# Altium schematic sheet lm1875 amplifier.SchDoc
size A3; SheetNumber: 1; SheetTotal: 1
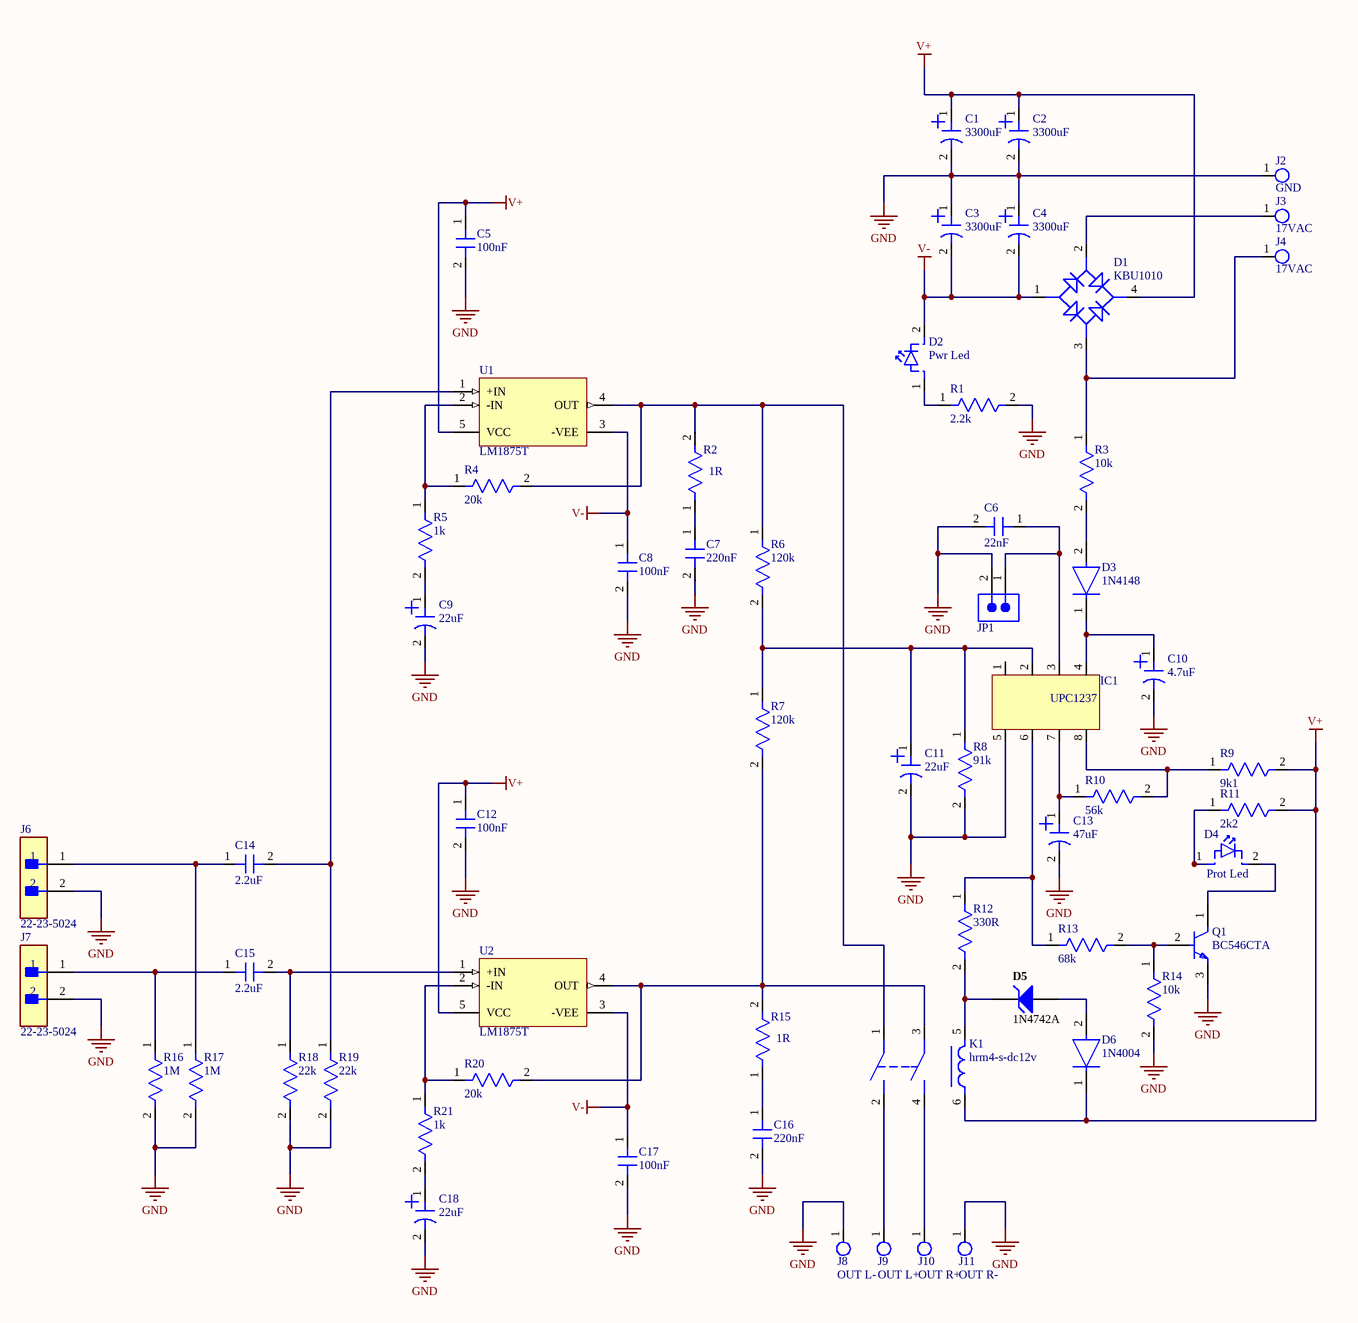
[diagram p0: lm1875 amplifier.SchDoc]

## Parts
C1  3300uF  [Capacitor electrolytic 16x21mm]
C2  3300uF  [Capacitor electrolytic 16x21mm]
C3  3300uF  [Capacitor electrolytic 16x21mm]
C4  3300uF  [Capacitor electrolytic 16x21mm]
C5  100nF  [Capacitor 3x7mm]
C6  22nF  [Capacitor 2.5x5mm]
C7  220nF  [Capacitor MKT 5x13mm]
C8  100nF  [Capacitor 3x7mm]
C9  22uF  [Capacitor 5x11mm]
C10  4.7uF  [Capacitor 5x11mm]
C11  22uF  [Capacitor 5x11mm]
C12  100nF  [Capacitor 3x7mm]
C13  47uF  [Capacitor 6x11mm]
C14  2.2uF  [Capacitor Bipolar 10x16mm Axial]
C15  2.2uF  [Capacitor Bipolar 10x16mm Axial]
C16  220nF  [Capacitor MKT 5x13mm]
C17  100nF  [Capacitor 3x7mm]
C18  22uF  [Capacitor 5x11mm]
D1  KBU1010  [KBU Rectifier]
D2  Pwr Led  [led 3mm]
D3  1N4148  [FP-017AG-MFG]
D4  Prot Led  [led 3mm]
D5  1N4742A  [FAIR-DO-41-2_V]
D6  1N4004  [FP-DO-41-MFG]
IC1  UPC1237  [SIP 8 PIN]
J2  GND  [Terminal 6.3mm male]
J3  17VAC  [Terminal 6.3mm male]
J4  17VAC  [Terminal 6.3mm male]
J6  22-23-5024  [FP-22-23-5024-MFG]
J7  22-23-5024  [FP-22-23-5024-MFG]
J8  OUT L-  [Terminal 6.3mm male]
J9  OUT L+  [Terminal 6.3mm male]
J10  OUT R+  [Terminal 6.3mm male]
J11  OUT R-  [Terminal 6.3mm male]
JP1  (no value)  [61300211121]
K1  hrm4-s-dc12v  [Relay hrm4-s-dc12v]
Q1  BC546CTA  [FP-135AR-MFG]
R1  2.2k  [Resistor 0207 1/4W]
R2  1R  [Resistor 1W]
R3  10k  [Resistor 0207 1/4W]
R4  20k  [Resistor 0207 1/4W wide legs]
R5  1k  [Resistor 0207 1/4W]
R6  120k  [Resistor 0207 1/4W]
R7  120k  [Resistor 0207 1/4W]
R8  91k  [Resistor 0207 1/4W]
R9  9k1  [Resistor 0207 1/4W]
R10  56k  [Resistor 0207 1/4W]
R11  2k2  [Resistor 0207 1/4W]
R12  330R  [Resistor 0207 1/4W]
R13  68k  [Resistor 0207 1/4W]
R14  10k  [Resistor 0207 1/4W]
R15  1R  [Resistor 1W]
R16  1M  [Resistor 0207 1/4W]
R17  1M  [Resistor 0207 1/4W]
R18  22k  [Resistor 0207 1/4W]
R19  22k  [Resistor 0207 1/4W]
R20  20k  [Resistor 0207 1/4W wide legs]
R21  1k  [Resistor 0207 1/4W]
U1  LM1875T  [NDH0005A]
U2  LM1875T  [NDH0005A]

## Nets
GND: C1.2 C2.2 C3.1 C4.1 C5.2 C6.2 C7.2 C8.2 C9.2 C10.2 C11.2 C12.2 C13.2 C16.2 C17.2 C18.2 IC1.5 J2.1 J6.2 J7.2 J8.1 J11.1 JP1.2 Q1.3(E) R1.2 R8.2 R14.2 R16.2 R17.2 R18.2 R19.2
V+: C1.1 C2.1 C5.1 C12.1 D1.4 D6.1(C) K1.6 R9.2 R11.2 U1.5(VCC) U2.5(VCC)
V-: C3.2 C4.2 C8.1 C17.1 D1.1 D2.2 U1.3(-VEE) U2.3(-VEE)
NetC6_1: C6.1 IC1.3 JP1.1
NetC7_1: C7.1 R2.1
NetC9_1: C9.1 R5.2
NetC10_1: C10.1 D3.1(C) IC1.4
NetC11_1: C11.1 IC1.2 R6.2 R7.1 R8.1
NetC13_1: C13.1 IC1.7 R10.1
NetC14_1: C14.1 J6.1 R17.1
NetC14_2: C14.2 R19.1 U1.1(+IN)
NetC15_1: C15.1 J7.1 R16.1
NetC15_2: C15.2 R18.1 U2.1(+IN)
NetC16_1: C16.1 R15.1
NetC18_1: C18.1 R21.2
NetD1_2: D1.2 J3.1
NetD1_3: D1.3 J4.1 R3.1
NetD2_1: D2.1 R1.1
NetD3_2: D3.2(A) R3.2
NetD4_1: D4.1 R11.1
NetD4_2: D4.2 Q1.1(C)
NetD5_1: D5.1(A) D6.2(A)
NetD5_2: D5.2(K) K1.5 R12.2
NetIC1_6: IC1.6 R12.1 R13.1
NetIC1_8: IC1.8 R9.1 R10.2
NetJ9_1: J9.1 K1.2
NetJ10_1: J10.1 K1.4
NetK1_1: K1.1 R2.2 R4.2 R6.1 U1.4(OUT)
NetK1_3: K1.3 R7.2 R15.2 R20.2 U2.4(OUT)
NetQ1_2: Q1.2(B) R13.2 R14.1
NetR4_1: R4.1 R5.1 U1.2(-IN)
NetR20_1: R20.1 R21.1 U2.2(-IN)

Not connected (* = marked no-connect by the designer): IC1 1

## Library data of the parts
C1-C4 = Capacitor 16x21mm
C5 C8 C12 C17 = Capacitor 3x7mm
C6 = Capacitor 2.5x5mm
C7 C16 = Capacitor MKT 5x13mm
C9-C11 C18 = Capacitor 5x11mm
C13 = Capacitor 6x11mm
C14 C15 = Capacitor Bipolar 10x16mm Axial
D1 = Diode Rectifier KBU
D2 D4 = Led 3mm
D3 = CMP-07163-000046-1: DIODE GEN PURP 100V 200MA DO35; Forward Voltage: 1V; Max Power Dissipation: 500mW; Max Reverse Current: 5uA; Forward Current: 300mA; Current: 4A; Reverse Recovery Time: 4ns; Element Configuration: Single; Outside Diameter: 1.85mm; Capacitance: 4pF; Polarity: Standard; Max Forward Surge Current (Ifsm): 1A; Reverse Voltage: 100V; Output Current: 200mA; Average Rectified Current: 200mA; Diameter: 1.91mm; Max Repetitive Reverse Voltage (Vrrm): 100V; Current Rating: 200mA; Case/Package: DO-35; Lead Free: Lead Free; Number of Pins: 2; Recovery Time: 4ns; Packaging: Bulk; Contact Plating: Tin; Voltage: 100V; Mount: Through Hole; Max Surge Current: 4A; Package Quantity: 2000; Width: 1.91mm; Max Reverse Voltage (DC): 100V; Length: 4.56mm; Radiation Hardening: No; Power Dissipation: 500mW; Voltage Rating (DC): 100V; Peak Non-Repetitive Surge Current: 4A; REACH SVHC: No SVHC; Height: 4.56mm; Max Operating Temperature: 175°C; Series: -; Weight: 0.01lb; Min Operating Temperature: -65°C
D5 = CMP-0892-00001-1: Zener Diode, 12V, 1W, 5%, -65 to 200 degC, 2-Pin DO-41, Body 2.72 x 5.2 mm, RoHS; Manufacturer: Fairchild Semiconductor; PD (W): 1; VZ (Min.) (V): 11.4; VZ (Max.) (V): 12.6; ZZ (Max) (ohm): 8; IR (uA): 5; Test Current IZ (mA): 21; PartNumber: 1N4742A; PackageVersion: Rev. 2; DatasheetVersion: Rev. H3; Mounting Technology: Through Hole; Tolerance: 5%; PackageDescription: 2-Pin Axial leaded, Body 2.72 x 5.2 mm, Lead Spread 25.4 mm; ComponentLink1Description: Manufacturer URL; ComponentLink3Description: Package Specification; ComponentLink2Description: Datasheet; ComponentLink2URL: http://www.fairchildsemi.com/ds/1N/1N4744A.pdf; PackageReference: DO-41-2; RoHS: TRUE; Operating and Storage Temperature Range: -65 to 200 degC; ComponentLink3URL: http://www.fairchildsemi.com/dwg/DO/DO41A.pdf; ComponentLink1URL: http://www.fairchildsemi.com/
D6 = CMP-56207-000012-1: DIODE GEN PURP 400V 1A DO41; Forward Voltage: 1V; Recovery Time: 2000ns; Capacitance: 15pF; Element Configuration: Single; Peak Non-Repetitive Surge Current: 30A; Reverse Recovery Time: 2us; Polarity: Standard; Max Reverse Current: 5uA; Max Reverse Voltage (DC): 400V; Min Operating Temperature: -55°C; Packaging: Tape and Reel; Reverse Voltage: 400V; RoHS Compliant: Yes; Case/Package: DO-41; Package Quantity: 1; Max Operating Temperature: 150°C; Mount: Through Hole; Forward Current: 1A; Current Rating: 1A; Voltage Rating (DC): 400V; Diameter: 2.7mm; Length: 5.2mm; Lead Free: Lead Free; Number of Pins: 2; Output Current: 1A; Max Repetitive Reverse Voltage (Vrrm): 400V; Radiation Hardening: No; Max Surge Current: 30A; Max Forward Surge Current (Ifsm): 30A; Average Rectified Current: 1A
J2-J4 J8-J11 = 6.3mm Male Terminal
J6 J7 = CMP-04776-000057-1: CONN HEADER VERT 2POS 2.54MM; Manufacturer: Molex; Current Rating: 4A; Conn Orientation: Straight; Number Of Contacts: 2; Voltage Rating: 500V; Conn Gender: Male; Number Of Rows: 1; Height: 8.43mm; Automotive: No; RoHS: TRUE; Device Class L2: Headers and Wire Housings; Contact Material: Tin,Nickel; Manufacturer Part Number: 22-23-5024; Category: Conn; Digikey Description: CONN HEADER VERT 2POS 2.54MM; ComponentLink2Description: Datasheet; ComponentLink2URL: https://www.molex.com/pdm_docs/sd/022235024_sd.pdf; Device Class L1: Connectors; Package: 22-23-5024; Octopart: https://octopart.com/22-23-5024-molex-6792956; Pitch: 2.54mm; Mouser Description: Headers & Wire Housings KK 100 Hdr Assy FLk Assy FLk 02 ckt Tin; Device Class L3: unset; Lead Free: Yes
JP1 = CMP-1712-00002-5: NexarPartId: 20081794; Operating Supply Voltage: 250V; Current Rating: 3A; Gender: Male; Number of Contacts: 2; Pitch: 2.54mm; Connector Type: Male Pin; Contact Resistance: 20mΩ; Contact Plating: Gold; Contact Material: Copper; Number of Pins: 2; Min Operating Temperature: -40°C; Packaging: Bulk; Lead Pitch: 2.54mm; Mount: Through Hole; Orientation: Vertical; RoHS: Compliant; REACH SVHC: No SVHC; Height: 8.94mm; Termination: Through Hole; Number of Positions: 2; Contact Mating Length: 5.9944mm; Color: Black; Contact Gender: Male; Number of Rows: 1; Housing Material: PBT; Lead Free: Lead Free; Voltage Rating: 250V; Max Operating Temperature: 125°C
K1 = Relay hrm4-s-dc12v
Q1 = CMP-00278-84408942-1: BC546CTA Small Signal Bipolar Transistor, 0.1A I(C), 65V V(BR)CEO, 1-Element, NPN, Silicon, TO-92; Manufacturer Lifecycle Status: ACTIVE; Gain Bandwidth Product: 300MHz; Emitter Base Voltage (VEBO): 6V; Element Configuration: Single; Max Power Dissipation: 500mW; Max Collector Current: 100mA; Number of Elements: 1; Collector Base Voltage (VCBO): 80V; Max Junction Temperature (Tj): 150°C; hFE Min: 110; Collector Emitter Saturation Voltage: 250mV; Lead Free: Lead Free; Max Breakdown Voltage: 65V; Collector Emitter Breakdown Voltage: 65V; Collector Emitter Voltage (VCEO): 65V; Voltage Rating (DC): 65V; Weight: 240mg; Polarity: NPN; Schedule B: 8541210080, 8541210080; Contact Plating: Tin; Lifecycle Status: Production; Mount: Through Hole; Length: 4.58mm; Number of Pins: 3; Current Rating: 100mA; Width: 3.86mm; Transition Frequency: 300MHz; Case/Package: TO-92-3; Frequency: 300MHz; Power Dissipation: 500mW; Max Operating Temperature: 150°C; Min Operating Temperature: -65°C; Max Frequency: 300MHz; Height: 4.58mm; Radiation Hardening: No; NexarPartId: 84408942; RoHS: Compliant
R1 R3-R14 R16-R21 = Resistor
R2 R15 = Resistor 1W
U1 U2 = CMP-0057-00634-4: 20-W Audio Power Amplifier, 5-pin TO-220; Manufacturer: Texas Instruments; PackageTopMarking: NSUZXYTTE#*LM1875T; CompType: Audio IC; PowerWise: N; ComponentLink1URL: http://www.ti.com/general/docs/lit/getliterature.tsp?genericPartNumber=LM1875&fileType=pdf; ComponentLink1Description: Datasheet URL; PackageReference: NDH0005A; PackageDescription: TO-220, Molded, Stagger Bend, 5 Lead; PinCount: 5; RoHS: N